# Altium schematic sheet iTag3_sensors.SchDoc
size A
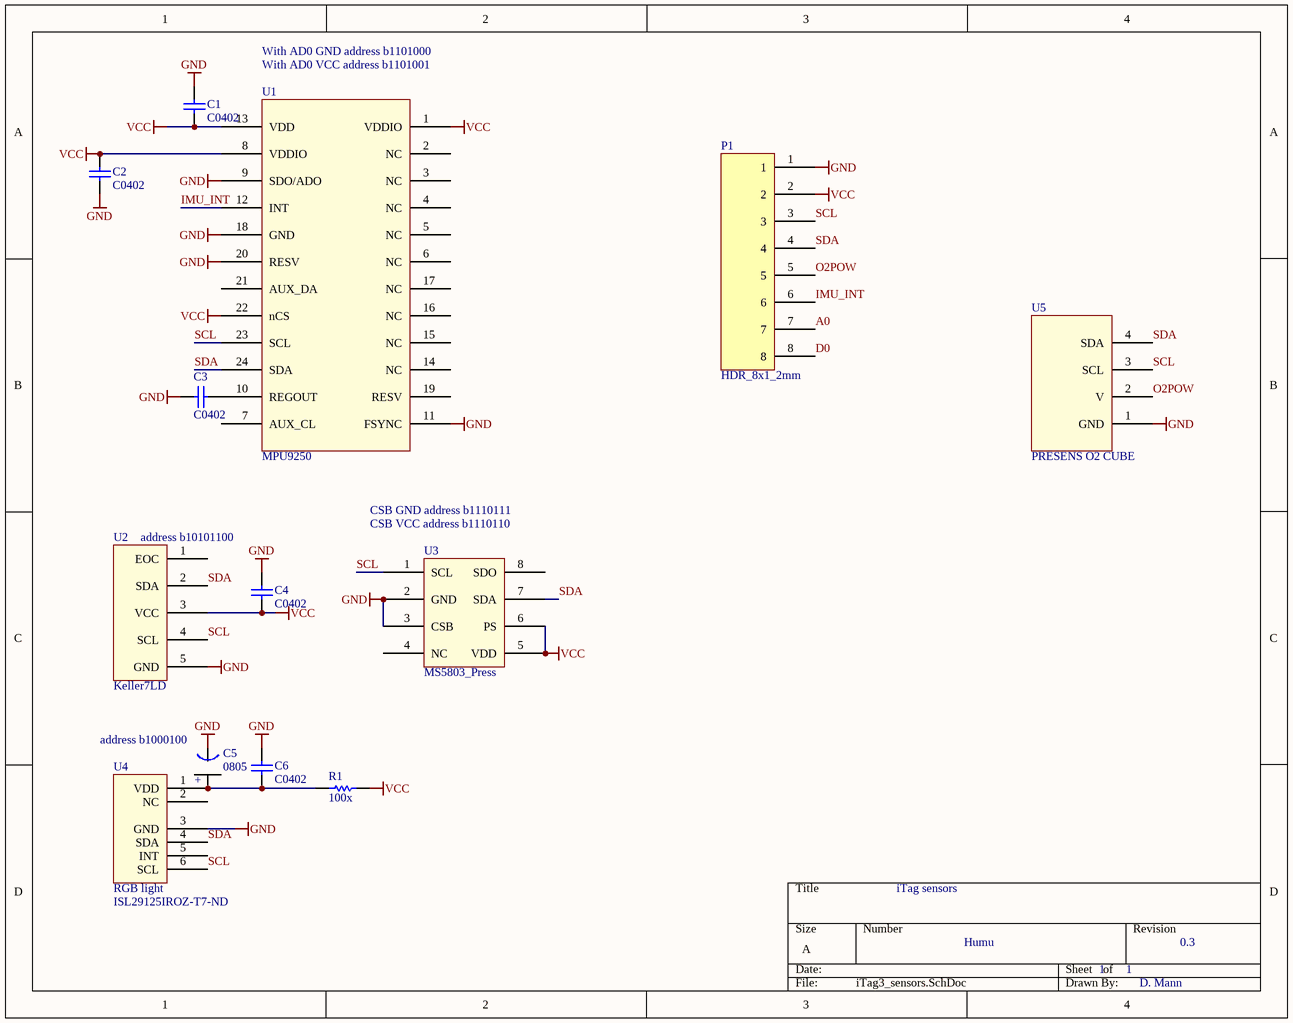
[diagram p0: iTag3_sensors.SchDoc]

## Parts
C1  C0402  [0402]
C2  C0402  [0402]
C3  C0402  [0402]
C4  C0402  [0402]
C5  0805  [Tant0805]
C6  C0402  [0402]
P1  HDR_8x1_2mm  [HDR_8x1_2mm]
R1  100x  [3-0603]
U1  MPU9250  [MPU6500]
U2  Keller7LD  [Keller7LD]
U3  MS5803_Press  [MS5803_Press]
U4  RGB light  Supplier Part Number 1: ISL29125IROZ-T7-ND  [ODFN]
U5  PRESENS O2 CUBE  [PRESENS_O2]

## Nets
GND: C1.2 C2.2 C3.1 C4.2 C5.1(GND) C6.2 P1.1 U1.9(SDO/ADO) U1.11(FSYNC) U1.18(GND) U1.20(RESV) U2.5(GND) U3.2(GND) U3.3(CSB) U4.3(GND) U5.1(GND)
VCC: C1.1 C2.1 C4.1 P1.2 R1.1 U1.1(VDDIO) U1.8(VDDIO) U1.13(VDD) U1.22(nCS) U2.3(VCC) U3.5(VDD) U3.6(PS)
A0: P1.7
D0: P1.8
IMU_INT: P1.6 U1.12(INT)
O2POW: P1.5 U5.2(V)
SCL: P1.3 U1.23(SCL) U2.4(SCL) U3.1(SCL) U4.6(SCL) U5.3(SCL)
SDA: P1.4 U1.24(SDA) U2.2(SDA) U3.7(SDA) U4.4(SDA) U5.4(SDA)
NetC3_2: C3.2 U1.10(REGOUT)
NetC5_2: C5.2(+) C6.1 R1.2 U4.1(VDD)

Not connected (* = marked no-connect by the designer): U1 2(NC) 3(NC) 4(NC) 5(NC) 6(NC) 7(AUX_CL) 14(NC) 15(NC) 16(NC) 17(NC) 19(RESV) 21(AUX_DA); U2 1(EOC); U3 4(NC) 8(SDO); U4 2(NC) 5(INT)

## Notes on the sheet
- With AD0 GND address b1101000
- With AD0 VCC address b1101001
- (near U2) address b10101100
- CSB GND address b1110111
- (near U3) CSB VCC address b1110110
- (near C5) address b1000100
- iTag sensors
- Humu
- 1
- 0.3
- D. Mann

## Library data of the parts
C1-C4 C6 = C0402: Ceramic Chip Capacitor - Standard; Note: Footprint corresponds to dimensions for bulk cassette packaging. This case size has tightened tolerances.; Value: 100pF; Published: 17-Jul-2002; LatestRevisionDate: 19-Mar-2004; LatestRevisionNote: Silkscreen size reduced.; DatasheetDocument: Mar-2001; PackageDocument: Mar-2001; PackageReference: 0402; Publisher: Altium Limited; Code_JEITA: 0402; Code_IPC: 1005 [0402]; ComponentLink1Description: Manufacturer Link; ComponentLink1URL: http://www.kemet.com/; ComponentLink2Description: Datasheet; ComponentLink2URL: http://www.kemet.com/kemet/web/homepage/kechome.nsf/vapubfilesname/F3102TA.pdf/$file/F3102TA.pdf
C5 = Tant0805: Value: *
R1 = ERJ3RK: Precision Thick Film Chip Resistor, 10 Ohm to 1M Ohm Range, 1% and 0.5% Tolerance, 0603 Size, 0.063 W; Published: 17-Dec-2003; LatestRevisionDate: 19-Mar-2004; LatestRevisionNote: Silkscreen size reduced.; PackageDocument: Mar-2003; PackageReference: 3-0603; Publisher: Altium Limited; Code_IPC: 1608 [0603]; ComponentLink1Description: Manufacturer Link; ComponentLink1URL: http://www.panasonic.com/industrial/components/resistive_products.htm; ComponentLink2Description: Datasheet; ComponentLink2URL: http://www.panasonic.com/industrial/components/pdf/AOA0000CE2.pdf
U1 = MPU-9250: Invensense
U2 = Keller 7LD: Keller Pressure/Temp; PDF: http://www.kelleramerica.com/pdf-library/Piezoresistive%20OEM%20Pressure%20Transmitters%20with%20I2C%20interface%20and%20embedded%20signal%20conditioning.pdf
U4 = ISL29125: RGB light sensor; Supplier 1: Digi-Key
U5 = PRESENS_O2